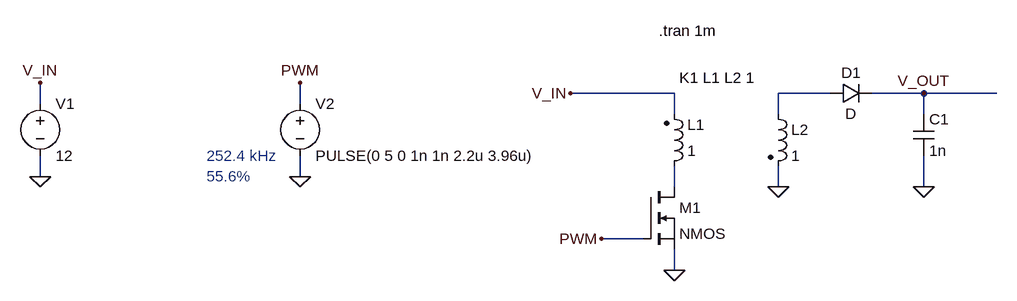
[diagram p0: schematic flyback.asc]
flyback.asc, the LTspice schematic file:
Version 4
SHEET 1 880 680
WIRE 0 0 -160 0
WIRE 240 0 160 0
WIRE 384 0 304 0
WIRE 496 0 384 0
WIRE -976 16 -976 -16
WIRE -576 16 -576 -16
WIRE 0 32 0 0
WIRE 160 32 160 0
WIRE 384 32 384 0
WIRE -976 128 -976 96
WIRE -576 128 -576 96
WIRE 0 144 0 112
WIRE 160 144 160 112
WIRE 384 144 384 96
WIRE -48 224 -112 224
WIRE 0 272 0 240
FLAG -976 128 0
FLAG 0 272 0
FLAG 384 0 V_OUT
FLAG -160 0 V_IN
FLAG -576 128 0
FLAG -576 -16 PWM
FLAG -976 -16 V_IN
FLAG 160 144 0
FLAG 384 144 0
FLAG -112 224 PWM
SYMBOL ind2 -16 128 M180
WINDOW 0 36 80 Left 2
WINDOW 3 36 40 Left 2
SYMATTR InstName L1
SYMATTR Value 1
SYMATTR Type ind
SYMBOL ind2 144 16 R0
SYMATTR InstName L2
SYMATTR Value 1
SYMATTR Type ind
SYMBOL voltage -976 0 R0
WINDOW 123 0 0 Left 0
WINDOW 39 24 124 Left 2
SYMATTR InstName V1
SYMATTR Value 12
SYMBOL voltage -576 0 R0
WINDOW 123 0 0 Left 0
WINDOW 39 0 0 Left 0
SYMATTR InstName V2
SYMATTR Value PULSE(0 5 0 1n 1n 2.2u 3.96u)
SYMBOL diode 240 16 R270
WINDOW 0 32 32 VTop 2
WINDOW 3 0 32 VBottom 2
SYMATTR InstName D1
SYMBOL nmos -48 144 R0
SYMATTR InstName M1
SYMBOL cap 368 32 R0
SYMATTR InstName C1
SYMATTR Value 1n
TEXT -24 -96 Left 2 !.tran 1m
TEXT 8 -24 Left 2 !K1 L1 L2 1
TEXT -720 96 Left 2 ;252.4 kHz\n55.6%

The netlist it stands for:
* flyback.asc
L1 N002 V_IN 1
L2 N001 0 1
V1 V_IN 0 12
V2 PWM 0 PULSE(0 5 0 1n 1n 2.2u 3.96u)
D1 N001 V_OUT D
M1 N002 PWM 0 0 NMOS
C1 V_OUT 0 1n
.model D D
.lib standard.dio
.model NMOS NMOS
.model PMOS PMOS
.lib standard.mos
.tran 1m
K1 L1 L2 1
* 252.4 kHz
* 55.6%
.backanno
.end